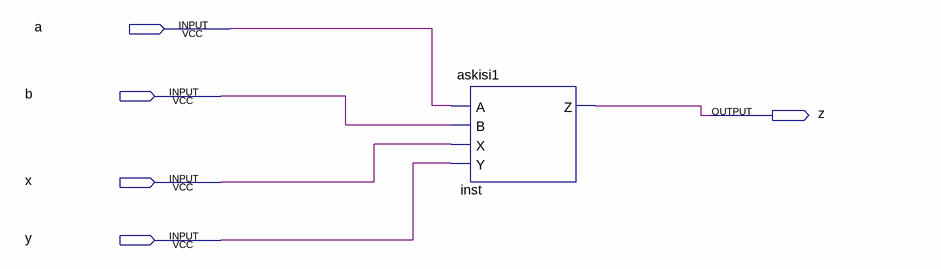
[diagram p0: schematic sheet]
// Quartus schematic Block2.bdf as structural Verilog: 1 symbols, 5 pins
module Block2 (
  input  a,
  input  b,
  input  x,
  input  y,
  output z
);

  askisi1 inst (.A(a), .B(b), .X(x), .Y(y), .Z(z));
endmodule
